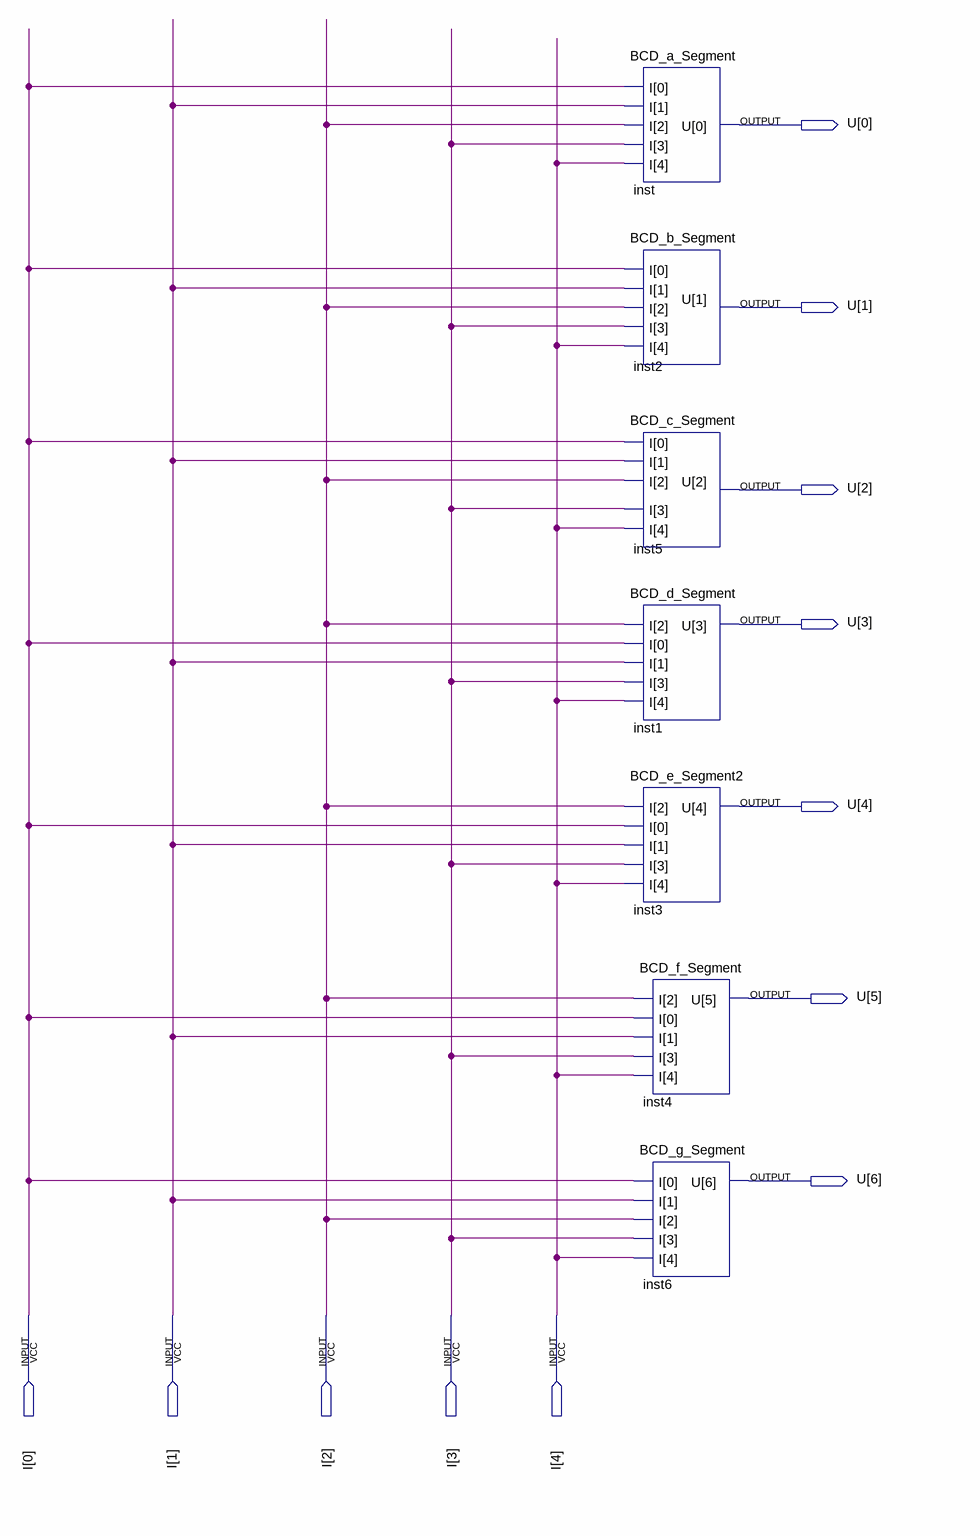
[diagram p0: schematic sheet]
// Quartus schematic BCDUNITY.bdf as structural Verilog: 7 symbols, 12 pins
module BCDUNITY (
  input  [4:0] I,
  output [6:0] U
);

  BCD_a_Segment inst (.I(I), .U(U[0]));
  BCD_b_Segment inst2 (.I(I), .U(U[1]));
  BCD_c_Segment inst5 (.I(I), .U(U[2]));
  BCD_d_Segment inst1 (.I(I), .U(U[3]));
  BCD_e_Segment2 inst3 (.I(I), .U(U[4]));
  BCD_f_Segment inst4 (.I(I), .U(U[5]));
  BCD_g_Segment inst6 (.I(I), .U(U[6]));
endmodule
